# Altium schematic sheet Sheet1.SchDoc
size A; SheetNumber: 5; SheetTotal: 5
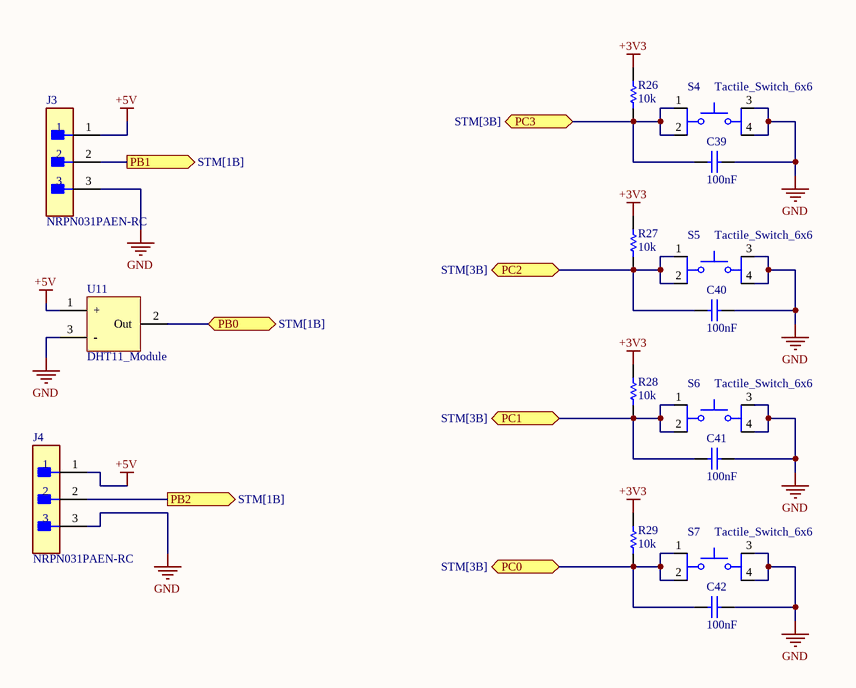
[diagram p0: Sheet1.SchDoc]

## Parts
C39  100nF  [CAP_0603]
C40  100nF  [CAP_0603]
C41  100nF  [CAP_0603]
C42  100nF  [CAP_0603]
J3  NRPN031PAEN-RC  [FP-NRPN031PAEN-RC-MFG]
J4  NRPN031PAEN-RC  [FP-NRPN031PAEN-RC-MFG]
R26  10k  [resistor_0603]
R27  10k  [resistor_0603]
R28  10k  [resistor_0603]
R29  10k  [resistor_0603]
S4  Tactile_Switch_6x6  [Tactile_Switch_6x6]
S5  Tactile_Switch_6x6  [Tactile_Switch_6x6]
S6  Tactile_Switch_6x6  [Tactile_Switch_6x6]
S7  Tactile_Switch_6x6  [Tactile_Switch_6x6]
U11  DHT11_Module  [DHT11_Module]

## Ports
PB0 (bidir, see STM[1B]), PB1 (out, see STM[1B]), PB2 (out, see STM[1B]), PC0 (bidir, see STM[3B]), PC1 (bidir, see STM[3B]), PC2 (bidir, see STM[3B]), PC3 (bidir, see STM[3B])

## Nets
+3V3: R26.1 R27.1 R28.1 R29.1
+5V: J3.1 J4.1 U11.1(+)
GND: C39.2 C40.2 C41.2 C42.2 J3.3 J4.3 S4.3 S4.4 S5.3 S5.4 S6.3 S6.4 S7.3 S7.4 U11.3(-)
PB0: U11.2(Out) ; port PB0
PB1: J3.2 ; port PB1
PB2: J4.2 ; port PB2
PC0: C42.1 R29.2 S7.1 S7.2 ; port PC0
PC1: C41.1 R28.2 S6.1 S6.2 ; port PC1
PC2: C40.1 R27.2 S5.1 S5.2 ; port PC2
PC3: C39.1 R26.2 S4.1 S4.2 ; port PC3

## Library data of the parts
C39-C42 = 01060310410: CAP, size 0603, 100nF; Supply 1 SN: 885012206095; Supply 1 name: Wurth Elektronik; Supply 2 name: Thegioiic; Capacitance Tolerance: +/-10%; ComponentLink1Description: Manufacturer; ComponentLink1URL: http://www.we-online.de; ComponentLink2Description: Datasheet; ComponentLink2URL: https://www.we-online.com/catalog/datasheet/885012206095.pdf; Operating Temperature: -55 to +125degC; Packaging: Tape and Reel; Supply 1 URL: https://www.we-online.com/en/components/products/WCAP-CSGP-50VDC?sq=885012206095R#885012206095R; Supply 2 SN: *; Supply 2 URL: https://www.thegioiic.com/tu-gom-0603-100nf-0-1uf-50v; Dissipation Factor: *; Height: *; Mounting Technology: SMT; Size: 0603; Capacitance: 100nF; Technical Reference: *
J3 J4 = CMP-25680-000021-1: CONN HEADER VERT 3POS 2MM; Manufacturer: Sullins; Number Of Contacts: 3; Conn Orientation: Straight; Voltage Rating: 150V; Conn Gender: Male; Current Rating: 2A; Temperature Range High: +105°C; Category: Conn; Manufacturer Part Number: NRPN031PAEN-RC; RoHS: TRUE; Contact Material: Gold,Nickel; ComponentLink2URL: https://drawings-pdf.s3.amazonaws.com/10531.pdf; Temperature: -40°C to +105°C; Lead Free: Yes; Octopart: https://octopart.com/nrpn031paen-rc-sullins-12817732; ComponentLink2Description: Datasheet; Pitch: 2mm; Number Of Rows: 1; Automotive: No; Height: 6mm; Device Class L2: Headers and Wire Housings; Digikey Description: CONN HEADER VERT 3POS 2MM; Package: 0; Device Class L3: unset; Temperature Range Low: -40°C; Device Class L1: Connectors
R26-R29 = 0006031031: RES, 10k Ohm, size 0603, 1%; Resistance Tolerant: +/-1%; Rated Power: 1/4W; Supply 1 Name: Mouser; Supply 1 SN: 755-ESR03EZPF1002; Supply 2 Name: Digikey; Supply 2 SN: RHM10KADTR-ND RHM10KADCT-ND RHM10KADDKR-ND; Resistance: 10k; Size: 0603; Mounting Technology: SMT; ComponentLink1Description: Datasheet link; ComponentLink1URL: https://fscdn.rohm.com/en/products/databook/datasheet/passive/resistor/chip_resistor/esr-e.pdf; ComponentLink2Description: Supply 1 URL; ComponentLink2URL: https://www.mouser.vn/ProductDetail/ROHM-Semiconductor/ESR03EZPF1002?qs=sGAEpiMZZMvdGkrng054t67Efho1F8r6CDeAsqwFse8%3D; ComponentLink3Description: Supply 2 URL; ComponentLink3URL: https://www.digikey.com/en/products/detail/rohm-semiconductor/ESR03EZPF1002/1983429
S4-S7 = Tactile_Switch_6x6: Tactile Switch, 6x6mm
U11 = DHT11_Module: Temperature & Humidity Sensor, 3.3V-5V, 5mA